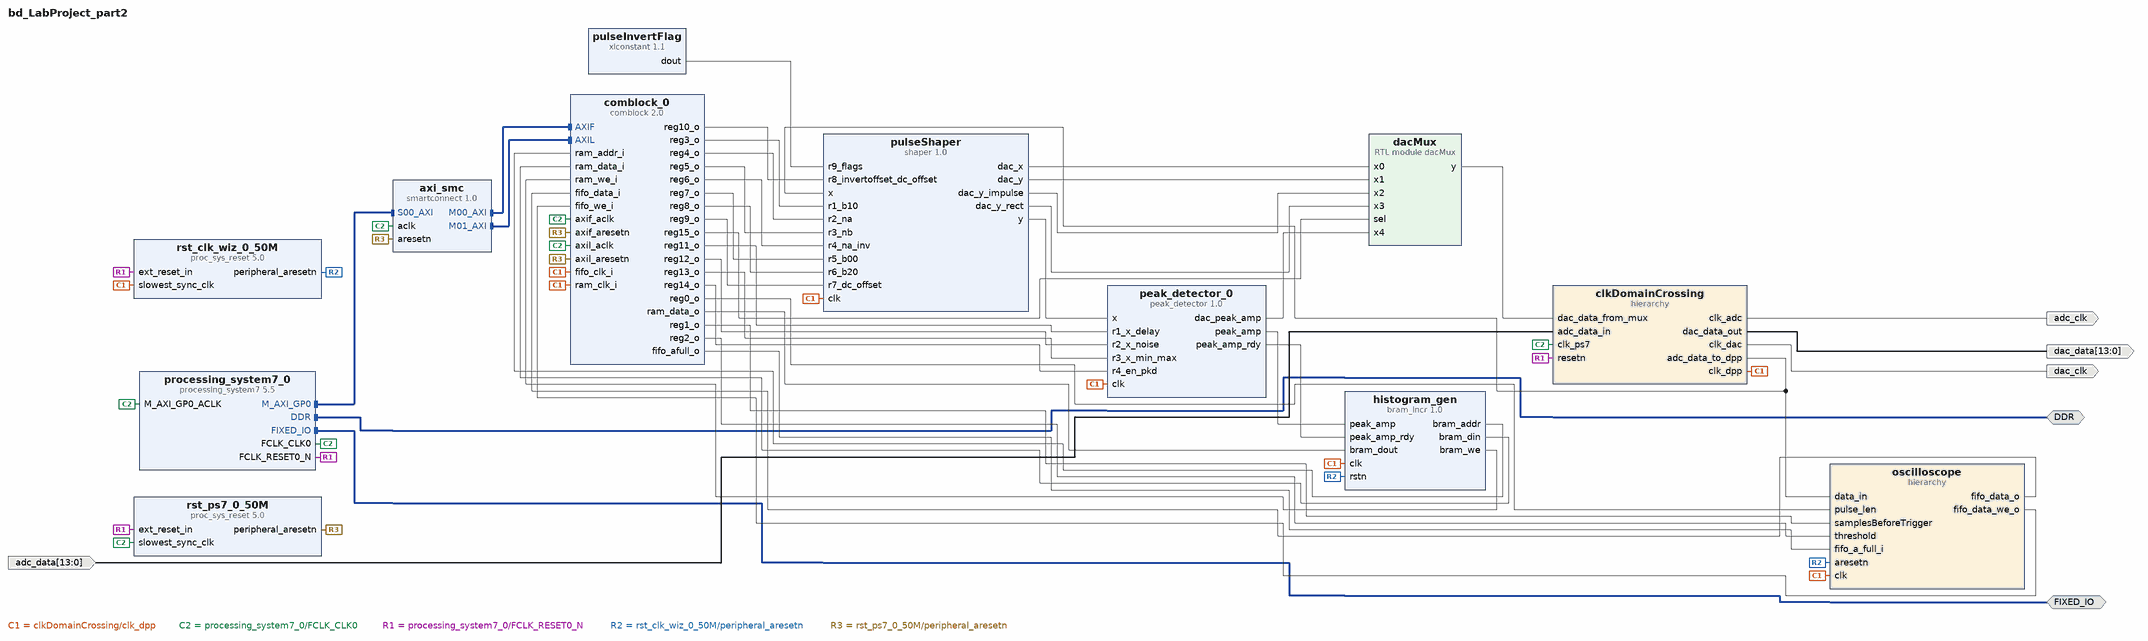
[diagram p0: block diagram of the top level]
# Vivado block design bd_LabProject_part2, xc7z020clg484-1, Vivado 2022.2
create_bd_design bd_LabProject_part2

create_bd_intf_port -mode Master -vlnv xilinx.com:interface:ddrx_rtl:1.0 DDR
create_bd_intf_port -mode Master -vlnv xilinx.com:display_processing_system7:fixedio_rtl:1.0 FIXED_IO
create_bd_port -dir O -type clk adc_clk
create_bd_port -dir I -from 13 -to 0 -type data adc_data
create_bd_port -dir O -type clk dac_clk
create_bd_port -dir O -from 13 -to 0 dac_data

create_bd_cell -type ip -vlnv xilinx.com:ip:smartconnect:1.0 axi_smc
set_property -dict {CONFIG.NUM_MI 2 CONFIG.NUM_SI 1} [get_bd_cells axi_smc]
create_bd_cell -type hier clkDomainCrossing
create_bd_cell -type ip -vlnv www.ictp.it:user:comblock:2.0 comblock_0
set_property -dict [list \
  CONFIG.DRAM_IO_AWIDTH 11 \
  CONFIG.DRAM_IO_DEPTH 2048 \
  CONFIG.DRAM_IO_DWIDTH 32 \
  CONFIG.FIFO_IN_DEPTH 2048 \
  CONFIG.FIFO_IN_DWIDTH 14 \
  CONFIG.REGS_IN_ENA false \
  CONFIG.REGS_OUT_DEPTH 16 \
] [get_bd_cells comblock_0]
create_bd_cell -type module -reference dacMux dacMux
create_bd_cell -type ip -vlnv xilinx.com:user:bram_incr:1.0 histogram_gen
create_bd_cell -type hier oscilloscope
create_bd_cell -type ip -vlnv IAEA:peak_detector:peak_detector:1.0 peak_detector_0
create_bd_cell -type ip -vlnv xilinx.com:ip:processing_system7:5.5 processing_system7_0
set_property -dict [list \
  CONFIG.PCW_APU_PERIPHERAL_FREQMHZ 666.666667 \
  CONFIG.PCW_ENET0_ENET0_IO {MIO 16 .. 27} \
  CONFIG.PCW_ENET0_GRP_MDIO_ENABLE 1 \
  CONFIG.PCW_ENET0_GRP_MDIO_IO {MIO 52 .. 53} \
  CONFIG.PCW_ENET0_PERIPHERAL_ENABLE 1 \
  CONFIG.PCW_ENET0_RESET_ENABLE 0 \
  CONFIG.PCW_ENET_RESET_ENABLE 1 \
  CONFIG.PCW_ENET_RESET_SELECT {Share reset pin} \
  CONFIG.PCW_FPGA0_PERIPHERAL_FREQMHZ 100 \
  CONFIG.PCW_FPGA1_PERIPHERAL_FREQMHZ 150.000000 \
  CONFIG.PCW_GPIO_MIO_GPIO_ENABLE 1 \
  CONFIG.PCW_GPIO_MIO_GPIO_IO MIO \
  CONFIG.PCW_I2C_RESET_ENABLE 1 \
  CONFIG.PCW_PRESET_BANK1_VOLTAGE {LVCMOS 1.8V} \
  CONFIG.PCW_QSPI_GRP_SINGLE_SS_ENABLE 1 \
  CONFIG.PCW_QSPI_GRP_SINGLE_SS_IO {MIO 1 .. 6} \
  CONFIG.PCW_QSPI_PERIPHERAL_ENABLE 1 \
  CONFIG.PCW_QSPI_QSPI_IO {MIO 1 .. 6} \
  CONFIG.PCW_SD0_GRP_CD_ENABLE 1 \
  CONFIG.PCW_SD0_GRP_CD_IO {MIO 47} \
  CONFIG.PCW_SD0_GRP_WP_ENABLE 1 \
  CONFIG.PCW_SD0_GRP_WP_IO {MIO 46} \
  CONFIG.PCW_SD0_PERIPHERAL_ENABLE 1 \
  CONFIG.PCW_SD0_SD0_IO {MIO 40 .. 45} \
  CONFIG.PCW_SDIO_PERIPHERAL_FREQMHZ 50 \
  CONFIG.PCW_SINGLE_QSPI_DATA_MODE x4 \
  CONFIG.PCW_UART1_PERIPHERAL_ENABLE 1 \
  CONFIG.PCW_UART1_UART1_IO {MIO 48 .. 49} \
  CONFIG.PCW_UART_PERIPHERAL_FREQMHZ 50 \
  CONFIG.PCW_UIPARAM_DDR_FREQ_MHZ 533.333313 \
  CONFIG.PCW_UIPARAM_DDR_PARTNO {MT41J128M16 HA-15E} \
  CONFIG.PCW_USB0_PERIPHERAL_ENABLE 0 \
  CONFIG.PCW_USB_RESET_ENABLE 1 \
  CONFIG.preset ZedBoard \
] [get_bd_cells processing_system7_0]
# 223 more settings of processing_system7_0 are not shown: defaults, MIO pin electricals, DDR timing, and values the tool derives
create_bd_cell -type ip -vlnv xilinx.com:ip:xlconstant:1.1 pulseInvertFlag
set_property -dict {CONFIG.CONST_VAL 0 CONFIG.CONST_WIDTH 32} [get_bd_cells pulseInvertFlag]
create_bd_cell -type ip -vlnv IAEA:shaper:shaper:1.0 pulseShaper
create_bd_cell -type ip -vlnv xilinx.com:ip:proc_sys_reset:5.0 rst_clk_wiz_0_50M
create_bd_cell -type ip -vlnv xilinx.com:ip:proc_sys_reset:5.0 rst_ps7_0_50M

# ---- hierarchy /clkDomainCrossing ----
current_bd_instance /clkDomainCrossing
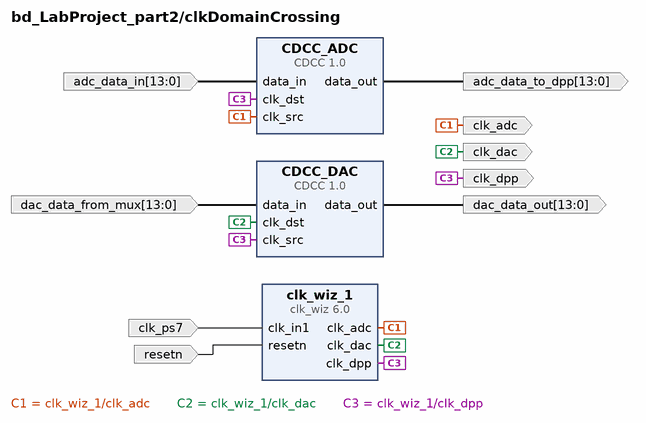
[diagram p1: block diagram inside /clkDomainCrossing]
create_bd_pin -dir I -from 13 -to 0 adc_data_in
create_bd_pin -dir O -from 13 -to 0 adc_data_to_dpp
create_bd_pin -dir O -type clk clk_adc
create_bd_pin -dir O -type clk clk_dac
create_bd_pin -dir O -type clk clk_dpp
create_bd_pin -dir I -type clk clk_ps7
create_bd_pin -dir I -from 13 -to 0 dac_data_from_mux
create_bd_pin -dir O -from 13 -to 0 dac_data_out
create_bd_pin -dir I -type rst resetn

create_bd_cell -type ip -vlnv IAEA:user:CDCC:1.0 CDCC_ADC
create_bd_cell -type ip -vlnv IAEA:user:CDCC:1.0 CDCC_DAC
create_bd_cell -type ip -vlnv xilinx.com:ip:clk_wiz:6.0 clk_wiz_1
set_property -dict [list \
  CONFIG.CLKIN1_JITTER_PS 100.0 \
  CONFIG.CLKOUT1_JITTER 137.504 \
  CONFIG.CLKOUT1_PHASE_ERROR 89.598 \
  CONFIG.CLKOUT1_REQUESTED_OUT_FREQ 50 \
  CONFIG.CLKOUT1_REQUESTED_PHASE 94.000 \
  CONFIG.CLKOUT2_JITTER 137.504 \
  CONFIG.CLKOUT2_PHASE_ERROR 89.598 \
  CONFIG.CLKOUT2_REQUESTED_OUT_FREQ 50 \
  CONFIG.CLKOUT2_USED true \
  CONFIG.CLKOUT3_JITTER 137.504 \
  CONFIG.CLKOUT3_PHASE_ERROR 89.598 \
  CONFIG.CLKOUT3_REQUESTED_OUT_FREQ 50 \
  CONFIG.CLKOUT3_REQUESTED_PHASE 134.000 \
  CONFIG.CLKOUT3_USED true \
  CONFIG.CLK_OUT1_PORT clk_dpp \
  CONFIG.CLK_OUT2_PORT clk_adc \
  CONFIG.CLK_OUT3_PORT clk_dac \
  CONFIG.MMCM_CLKFBOUT_MULT_F 11.500 \
  CONFIG.MMCM_CLKIN1_PERIOD 10.000 \
  CONFIG.MMCM_CLKIN2_PERIOD 10.000 \
  CONFIG.MMCM_CLKOUT0_DIVIDE_F 23.000 \
  CONFIG.MMCM_CLKOUT0_PHASE 93.913 \
  CONFIG.MMCM_CLKOUT1_DIVIDE 23 \
  CONFIG.MMCM_CLKOUT2_DIVIDE 23 \
  CONFIG.MMCM_CLKOUT2_PHASE 133.043 \
  CONFIG.NUM_OUT_CLKS 3 \
  CONFIG.RESET_PORT resetn \
  CONFIG.RESET_TYPE ACTIVE_LOW \
  CONFIG.USE_LOCKED false \
] [get_bd_cells clk_wiz_1]

# ---- hierarchy /oscilloscope ----
current_bd_instance /oscilloscope
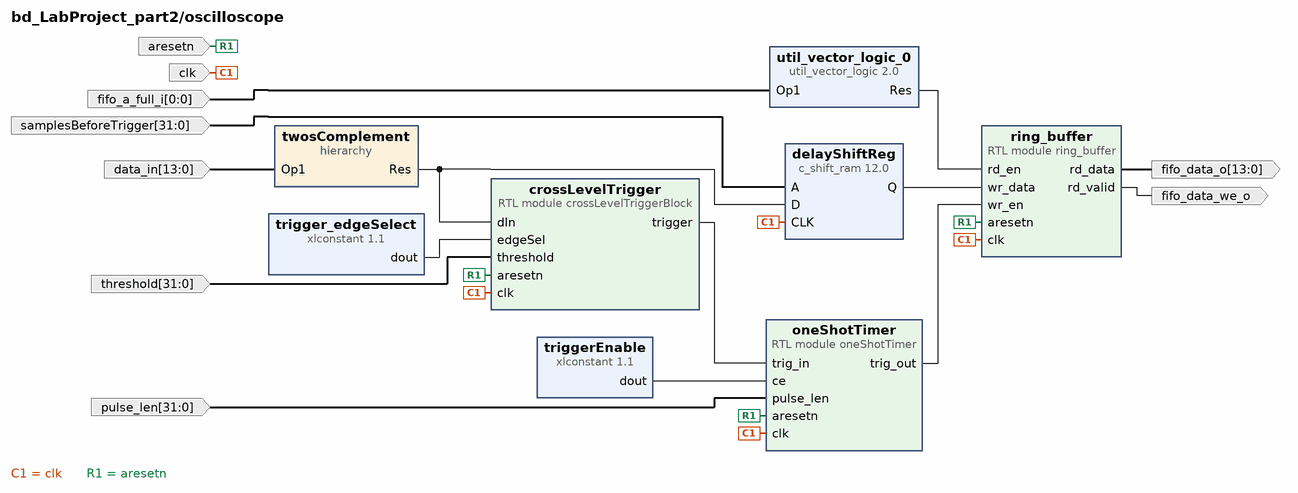
[diagram p2: block diagram inside /oscilloscope]
create_bd_pin -dir I -type rst aresetn
create_bd_pin -dir I -type clk clk
create_bd_pin -dir I -from 13 -to 0 data_in
create_bd_pin -dir I -from 0 -to 0 fifo_a_full_i
create_bd_pin -dir O -from 13 -to 0 fifo_data_o
create_bd_pin -dir O fifo_data_we_o
create_bd_pin -dir I -from 31 -to 0 pulse_len
create_bd_pin -dir I -from 31 -to 0 -type data samplesBeforeTrigger
create_bd_pin -dir I -from 31 -to 0 threshold

create_bd_cell -type module -reference crossLevelTriggerBlock crossLevelTrigger
create_bd_cell -type ip -vlnv xilinx.com:ip:c_shift_ram:12.0 delayShiftReg
set_property -dict [list \
  CONFIG.AsyncInitRadix 16 \
  CONFIG.DefaultDataRadix 16 \
  CONFIG.Depth 1024 \
  CONFIG.ShiftRegType Variable_Length_Lossless \
  CONFIG.Width 14 \
] [get_bd_cells delayShiftReg]
create_bd_cell -type module -reference oneShotTimer oneShotTimer
create_bd_cell -type module -reference ring_buffer ring_buffer
create_bd_cell -type ip -vlnv xilinx.com:ip:xlconstant:1.1 triggerEnable
set_property -dict {CONFIG.CONST_VAL 1} [get_bd_cells triggerEnable]
create_bd_cell -type ip -vlnv xilinx.com:ip:xlconstant:1.1 trigger_edgeSelect
set_property -dict {CONFIG.CONST_VAL 0} [get_bd_cells trigger_edgeSelect]
create_bd_cell -type hier twosComplement
create_bd_cell -type ip -vlnv xilinx.com:ip:util_vector_logic:2.0 util_vector_logic_0
set_property -dict {CONFIG.C_OPERATION not CONFIG.C_SIZE 1} [get_bd_cells util_vector_logic_0]

# ---- hierarchy /oscilloscope/twosComplement ----
current_bd_instance /oscilloscope/twosComplement
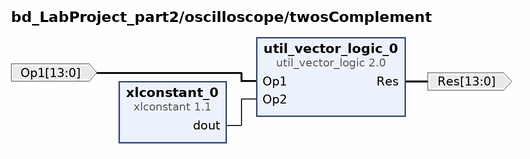
[diagram p3: block diagram inside /oscilloscope/twosComplement]
create_bd_pin -dir I -from 13 -to 0 Op1
create_bd_pin -dir O -from 13 -to 0 Res

create_bd_cell -type ip -vlnv xilinx.com:ip:util_vector_logic:2.0 util_vector_logic_0
set_property -dict {CONFIG.C_OPERATION xor CONFIG.C_SIZE 14} [get_bd_cells util_vector_logic_0]
create_bd_cell -type ip -vlnv xilinx.com:ip:xlconstant:1.1 xlconstant_0
set_property -dict {CONFIG.CONST_VAL 8192 CONFIG.CONST_WIDTH 14} [get_bd_cells xlconstant_0]

# ---- connections ----

current_bd_instance /clkDomainCrossing
connect_bd_net [get_bd_pins CDCC_ADC/data_out] [get_bd_pins adc_data_to_dpp]
connect_bd_net [get_bd_pins CDCC_DAC/data_out] [get_bd_pins dac_data_out]
connect_bd_net -net Op1_1 [get_bd_pins dac_data_from_mux] [get_bd_pins CDCC_DAC/data_in]
connect_bd_net -net adc_data_1 [get_bd_pins adc_data_in] [get_bd_pins CDCC_ADC/data_in]
connect_bd_net -net clk_wiz_0_clk_adc [get_bd_pins clk_wiz_1/clk_adc] [get_bd_pins clk_adc] [get_bd_pins CDCC_ADC/clk_src]
connect_bd_net -net clk_wiz_0_clk_dac [get_bd_pins clk_wiz_1/clk_dac] [get_bd_pins clk_dac] [get_bd_pins CDCC_DAC/clk_dst]
connect_bd_net -net clk_wiz_0_clk_dpp [get_bd_pins clk_wiz_1/clk_dpp] \
  [get_bd_pins clk_dpp] [get_bd_pins CDCC_ADC/clk_dst] [get_bd_pins CDCC_DAC/clk_src]
connect_bd_net -net processing_system7_0_FCLK_CLK0 [get_bd_pins clk_ps7] [get_bd_pins clk_wiz_1/clk_in1]
connect_bd_net -net processing_system7_0_FCLK_RESET0_N [get_bd_pins resetn] [get_bd_pins clk_wiz_1/resetn]

current_bd_instance /oscilloscope
connect_bd_net -net A_1 [get_bd_pins samplesBeforeTrigger] [get_bd_pins delayShiftReg/A]
connect_bd_net -net Op2_1 [get_bd_pins fifo_a_full_i] [get_bd_pins util_vector_logic_0/Op1]
connect_bd_net -net c_shift_ram_0_Q [get_bd_pins delayShiftReg/Q] [get_bd_pins ring_buffer/wr_data]
connect_bd_net -net clkDomainCrossing_clk_dpp [get_bd_pins clk] \
  [get_bd_pins crossLevelTrigger/clk] [get_bd_pins delayShiftReg/CLK] [get_bd_pins oneShotTimer/clk] \
  [get_bd_pins ring_buffer/clk]
connect_bd_net -net crossLevelTriggerBlo_0_trigger [get_bd_pins crossLevelTrigger/trigger] [get_bd_pins oneShotTimer/trig_in]
connect_bd_net [get_bd_pins data_in] [get_bd_pins twosComplement/Op1]
connect_bd_net -net oneShotTimer_0_trig_out [get_bd_pins oneShotTimer/trig_out] [get_bd_pins ring_buffer/wr_en]
connect_bd_net [get_bd_pins pulse_len] [get_bd_pins oneShotTimer/pulse_len]
connect_bd_net -net ring_buffer_0_rd_data [get_bd_pins ring_buffer/rd_data] [get_bd_pins fifo_data_o]
connect_bd_net -net ring_buffer_0_rd_valid [get_bd_pins ring_buffer/rd_valid] [get_bd_pins fifo_data_we_o]
connect_bd_net -net rst_clk_wiz_0_50M_peripheral_aresetn [get_bd_pins aresetn] \
  [get_bd_pins crossLevelTrigger/aresetn] [get_bd_pins oneShotTimer/aresetn] [get_bd_pins ring_buffer/aresetn]
connect_bd_net [get_bd_pins threshold] [get_bd_pins crossLevelTrigger/threshold]
connect_bd_net [get_bd_pins triggerEnable/dout] [get_bd_pins oneShotTimer/ce]
connect_bd_net [get_bd_pins trigger_edgeSelect/dout] [get_bd_pins crossLevelTrigger/edgeSel]
connect_bd_net [get_bd_pins twosComplement/Res] [get_bd_pins crossLevelTrigger/dIn] [get_bd_pins delayShiftReg/D]
connect_bd_net [get_bd_pins util_vector_logic_0/Res] [get_bd_pins ring_buffer/rd_en]

current_bd_instance /oscilloscope/twosComplement
connect_bd_net -net Op1_1 [get_bd_pins Op1] [get_bd_pins util_vector_logic_0/Op1]
connect_bd_net [get_bd_pins util_vector_logic_0/Res] [get_bd_pins Res]
connect_bd_net [get_bd_pins xlconstant_0/dout] [get_bd_pins util_vector_logic_0/Op2]

current_bd_instance /
connect_bd_intf_net [get_bd_intf_pins axi_smc/M00_AXI] [get_bd_intf_pins comblock_0/AXIF]
connect_bd_intf_net [get_bd_intf_pins axi_smc/M01_AXI] [get_bd_intf_pins comblock_0/AXIL]
connect_bd_intf_net [get_bd_intf_ports DDR] [get_bd_intf_pins processing_system7_0/DDR]
connect_bd_intf_net [get_bd_intf_ports FIXED_IO] [get_bd_intf_pins processing_system7_0/FIXED_IO]
connect_bd_intf_net [get_bd_intf_pins axi_smc/S00_AXI] [get_bd_intf_pins processing_system7_0/M_AXI_GP0]
connect_bd_net -net CDCC_DAC_data_out [get_bd_pins clkDomainCrossing/dac_data_out] [get_bd_ports dac_data]
connect_bd_net -net Op1_1 [get_bd_pins clkDomainCrossing/adc_data_to_dpp] [get_bd_pins oscilloscope/data_in] [get_bd_pins pulseShaper/x]
connect_bd_net [get_bd_ports adc_data] [get_bd_pins clkDomainCrossing/adc_data_in]
connect_bd_net [get_bd_pins clkDomainCrossing/clk_adc] [get_bd_ports adc_clk]
connect_bd_net [get_bd_pins clkDomainCrossing/clk_dac] [get_bd_ports dac_clk]
connect_bd_net [get_bd_pins clkDomainCrossing/clk_dpp] \
  [get_bd_pins comblock_0/fifo_clk_i] [get_bd_pins comblock_0/ram_clk_i] [get_bd_pins histogram_gen/clk] \
  [get_bd_pins oscilloscope/clk] [get_bd_pins peak_detector_0/clk] [get_bd_pins pulseShaper/clk] \
  [get_bd_pins rst_clk_wiz_0_50M/slowest_sync_clk]
connect_bd_net -net clk_ps7_1 [get_bd_pins processing_system7_0/FCLK_CLK0] \
  [get_bd_pins axi_smc/aclk] [get_bd_pins clkDomainCrossing/clk_ps7] [get_bd_pins comblock_0/axif_aclk] \
  [get_bd_pins comblock_0/axil_aclk] [get_bd_pins processing_system7_0/M_AXI_GP0_ACLK] \
  [get_bd_pins rst_ps7_0_50M/slowest_sync_clk]
connect_bd_net [get_bd_pins comblock_0/ram_data_o] [get_bd_pins histogram_gen/bram_dout]
connect_bd_net [get_bd_pins comblock_0/reg0_o] [get_bd_pins oscilloscope/pulse_len]
connect_bd_net [get_bd_pins comblock_0/reg10_o] [get_bd_pins pulseShaper/r8_invertoffset_dc_offset]
connect_bd_net [get_bd_pins comblock_0/reg11_o] [get_bd_pins peak_detector_0/r1_x_delay]
connect_bd_net [get_bd_pins comblock_0/reg12_o] [get_bd_pins peak_detector_0/r2_x_noise]
connect_bd_net [get_bd_pins comblock_0/reg13_o] [get_bd_pins peak_detector_0/r3_x_min_max]
connect_bd_net [get_bd_pins comblock_0/reg14_o] [get_bd_pins peak_detector_0/r4_en_pkd]
connect_bd_net [get_bd_pins comblock_0/reg15_o] [get_bd_pins dacMux/sel]
connect_bd_net [get_bd_pins comblock_0/reg1_o] [get_bd_pins oscilloscope/samplesBeforeTrigger]
connect_bd_net [get_bd_pins comblock_0/reg2_o] [get_bd_pins oscilloscope/threshold]
connect_bd_net [get_bd_pins comblock_0/reg3_o] [get_bd_pins pulseShaper/r1_b10]
connect_bd_net [get_bd_pins comblock_0/reg4_o] [get_bd_pins pulseShaper/r2_na]
connect_bd_net [get_bd_pins comblock_0/reg5_o] [get_bd_pins pulseShaper/r3_nb]
connect_bd_net [get_bd_pins comblock_0/reg6_o] [get_bd_pins pulseShaper/r4_na_inv]
connect_bd_net [get_bd_pins comblock_0/reg7_o] [get_bd_pins pulseShaper/r5_b00]
connect_bd_net [get_bd_pins comblock_0/reg8_o] [get_bd_pins pulseShaper/r6_b20]
connect_bd_net [get_bd_pins comblock_0/reg9_o] [get_bd_pins pulseShaper/r7_dc_offset]
connect_bd_net [get_bd_pins dacMux/y] [get_bd_pins clkDomainCrossing/dac_data_from_mux]
connect_bd_net -net fifo_a_full_i_1 [get_bd_pins comblock_0/fifo_afull_o] [get_bd_pins oscilloscope/fifo_a_full_i]
connect_bd_net [get_bd_pins histogram_gen/bram_addr] [get_bd_pins comblock_0/ram_addr_i]
connect_bd_net [get_bd_pins histogram_gen/bram_din] [get_bd_pins comblock_0/ram_data_i]
connect_bd_net [get_bd_pins histogram_gen/bram_we] [get_bd_pins comblock_0/ram_we_i]
connect_bd_net [get_bd_pins oscilloscope/fifo_data_o] [get_bd_pins comblock_0/fifo_data_i]
connect_bd_net [get_bd_pins oscilloscope/fifo_data_we_o] [get_bd_pins comblock_0/fifo_we_i]
connect_bd_net [get_bd_pins peak_detector_0/dac_peak_amp] [get_bd_pins dacMux/x4]
connect_bd_net [get_bd_pins peak_detector_0/peak_amp] [get_bd_pins histogram_gen/peak_amp]
connect_bd_net [get_bd_pins peak_detector_0/peak_amp_rdy] [get_bd_pins histogram_gen/peak_amp_rdy]
connect_bd_net [get_bd_pins processing_system7_0/FCLK_RESET0_N] \
  [get_bd_pins clkDomainCrossing/resetn] [get_bd_pins rst_clk_wiz_0_50M/ext_reset_in] \
  [get_bd_pins rst_ps7_0_50M/ext_reset_in]
connect_bd_net [get_bd_pins pulseShaper/dac_x] [get_bd_pins dacMux/x0]
connect_bd_net [get_bd_pins pulseShaper/dac_y] [get_bd_pins dacMux/x1]
connect_bd_net [get_bd_pins pulseShaper/dac_y_impulse] [get_bd_pins dacMux/x2]
connect_bd_net [get_bd_pins pulseShaper/dac_y_rect] [get_bd_pins dacMux/x3]
connect_bd_net [get_bd_pins pulseShaper/y] [get_bd_pins peak_detector_0/x]
connect_bd_net [get_bd_pins rst_clk_wiz_0_50M/peripheral_aresetn] [get_bd_pins histogram_gen/rstn] [get_bd_pins oscilloscope/aresetn]
connect_bd_net [get_bd_pins rst_ps7_0_50M/peripheral_aresetn] \
  [get_bd_pins axi_smc/aresetn] [get_bd_pins comblock_0/axif_aresetn] [get_bd_pins comblock_0/axil_aresetn]
connect_bd_net -net xlconstant_0_dout [get_bd_pins pulseInvertFlag/dout] [get_bd_pins pulseShaper/r9_flags]

# ---- address map ----
assign_bd_address -offset 0x43C00000 -range 256K -target_address_space [get_bd_addr_spaces processing_system7_0/Data] [get_bd_addr_segs comblock_0/AXIF/AXIF]
assign_bd_address -offset 0x43C40000 -range 64K -target_address_space [get_bd_addr_spaces processing_system7_0/Data] [get_bd_addr_segs comblock_0/AXIL/AXIL]

validate_bd_design
save_bd_design
